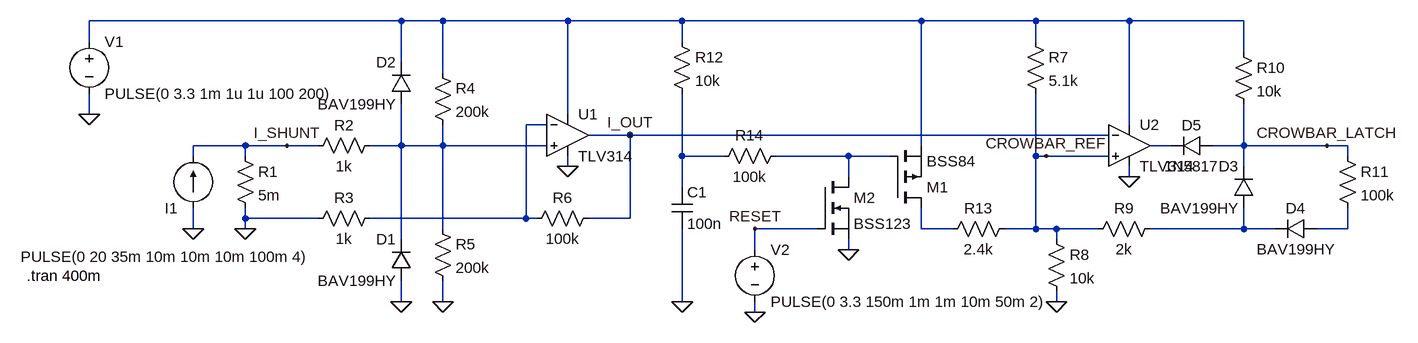
[diagram p0: schematic Crowbar_latch.asc]
Crowbar_latch.asc, the LTspice schematic file:
Version 4.1
SHEET 1 1932 680
WIRE 384 -16 -96 -16
WIRE 448 -16 384 -16
WIRE 640 -16 448 -16
WIRE 816 -16 640 -16
WIRE 1184 -16 816 -16
WIRE 1360 -16 1184 -16
WIRE 1504 -16 1360 -16
WIRE 1680 -16 1504 -16
WIRE -96 16 -96 -16
WIRE 816 16 816 -16
WIRE 1360 16 1360 -16
WIRE 1680 32 1680 -16
WIRE 384 48 384 -16
WIRE 448 64 448 -16
WIRE -96 128 -96 96
WIRE 640 128 640 -16
WIRE 608 144 576 144
WIRE 1504 144 1504 -16
WIRE 736 160 672 160
WIRE 1472 160 736 160
WIRE 144 176 64 176
WIRE 208 176 144 176
WIRE 256 176 208 176
WIRE 384 176 384 112
WIRE 384 176 336 176
WIRE 448 176 448 144
WIRE 448 176 384 176
WIRE 608 176 448 176
WIRE 1184 176 1184 -16
WIRE 1568 176 1536 176
WIRE 1680 176 1680 112
WIRE 1680 176 1632 176
WIRE 1808 176 1680 176
WIRE 1840 176 1808 176
WIRE 64 192 64 176
WIRE 144 192 144 176
WIRE 816 192 816 96
WIRE 880 192 816 192
WIRE 1072 192 960 192
WIRE 1136 192 1072 192
WIRE 1360 192 1360 96
WIRE 1376 192 1360 192
WIRE 1472 192 1376 192
WIRE 1840 192 1840 176
WIRE 640 208 640 192
WIRE 1680 208 1680 176
WIRE 1072 224 1072 192
WIRE 1504 224 1504 208
WIRE 816 240 816 192
WIRE 144 288 144 272
WIRE 256 288 144 288
WIRE 576 288 576 144
WIRE 576 288 336 288
WIRE 592 288 576 288
WIRE 736 288 736 160
WIRE 736 288 672 288
WIRE 64 304 64 272
WIRE 144 304 144 288
WIRE 448 304 448 176
WIRE 1024 304 928 304
WIRE 1184 304 1184 272
WIRE 1232 304 1184 304
WIRE 1360 304 1360 192
WIRE 1360 304 1312 304
WIRE 1392 304 1360 304
WIRE 1456 304 1392 304
WIRE 1680 304 1680 272
WIRE 1680 304 1536 304
WIRE 1728 304 1680 304
WIRE 1840 304 1840 272
WIRE 1840 304 1792 304
WIRE 384 320 384 176
WIRE 1392 320 1392 304
WIRE 928 336 928 304
WIRE 1072 336 1072 320
WIRE 384 416 384 384
WIRE 448 416 448 384
WIRE 816 416 816 304
WIRE 1392 416 1392 400
WIRE 928 432 928 416
FLAG 144 304 0
FLAG -96 128 0
FLAG 64 304 0
FLAG 384 416 0
FLAG 448 416 0
FLAG 640 208 0
FLAG 1504 224 0
FLAG 1392 416 0
FLAG 208 176 I_SHUNT
FLAG 736 160 I_OUT
FLAG 1808 176 CROWBAR_LATCH
FLAG 1376 192 CROWBAR_REF
FLAG 816 416 0
FLAG 1072 336 0
FLAG 928 432 0
FLAG 928 304 RESET
SYMBOL voltage -96 0 R0
WINDOW 123 0 0 Left 0
WINDOW 39 0 0 Left 0
SYMATTR InstName V1
SYMATTR Value PULSE(0 3.3 1m 1u 1u 100 200)
SYMBOL current 64 272 R180
WINDOW 123 0 0 Left 0
WINDOW 39 0 0 Left 0
WINDOW 3 -180 -75 Left 2
SYMATTR Value PULSE(0 20 35m 10m 10m 10m 100m 4)
SYMATTR InstName I1
SYMBOL res 128 176 R0
SYMATTR InstName R1
SYMATTR Value 5m
SYMBOL res 352 160 R90
WINDOW 0 0 56 VBottom 2
WINDOW 3 32 56 VTop 2
SYMATTR InstName R2
SYMATTR Value 1k
SYMBOL res 352 272 R90
WINDOW 0 0 56 VBottom 2
WINDOW 3 32 56 VTop 2
SYMATTR InstName R3
SYMATTR Value 1k
SYMBOL diode 400 384 R180
WINDOW 0 24 64 Left 2
WINDOW 3 24 0 Left 2
SYMATTR InstName D1
SYMATTR Value BAV199HY
SYMBOL diode 400 112 R180
WINDOW 0 24 64 Left 2
WINDOW 3 24 0 Left 2
SYMATTR InstName D2
SYMATTR Value BAV199HY
SYMBOL res 432 48 R0
SYMATTR InstName R4
SYMATTR Value 200k
SYMBOL res 432 288 R0
SYMATTR InstName R5
SYMATTR Value 200k
SYMBOL TLV314 640 160 R0
SYMATTR InstName U1
SYMBOL res 688 272 R90
WINDOW 0 0 56 VBottom 2
WINDOW 3 32 56 VTop 2
SYMATTR InstName R6
SYMATTR Value 100k
SYMBOL TLV314 1504 176 R0
SYMATTR InstName U2
SYMBOL res 1344 0 R0
SYMATTR InstName R7
SYMATTR Value 5.1k
SYMBOL res 1376 304 R0
SYMATTR InstName R8
SYMATTR Value 10k
SYMBOL res 1552 288 R90
WINDOW 0 0 56 VBottom 2
WINDOW 3 32 56 VTop 2
SYMATTR InstName R9
SYMATTR Value 2k
SYMBOL diode 1696 272 R180
WINDOW 0 24 64 Left 2
WINDOW 3 24 0 Left 2
SYMATTR InstName D3
SYMATTR Value BAV199HY
SYMBOL res 1664 16 R0
SYMATTR InstName R10
SYMATTR Value 10k
SYMBOL res 1824 176 R0
SYMATTR InstName R11
SYMATTR Value 100k
SYMBOL diode 1792 288 R90
WINDOW 0 0 32 VBottom 2
WINDOW 3 32 32 VTop 2
SYMATTR InstName D4
SYMATTR Value BAV199HY
SYMBOL pmos 1136 272 M180
SYMATTR InstName M1
SYMATTR Value BSS84
SYMBOL res 800 0 R0
SYMATTR InstName R12
SYMATTR Value 10k
SYMBOL cap 800 240 R0
SYMATTR InstName C1
SYMATTR Value 100n
SYMBOL diode 1632 160 R90
WINDOW 0 0 32 VBottom 2
WINDOW 3 32 32 VTop 2
SYMATTR InstName D5
SYMATTR Value 1N5817
SYMBOL res 1328 288 R90
WINDOW 0 0 56 VBottom 2
WINDOW 3 32 56 VTop 2
SYMATTR InstName R13
SYMATTR Value 2.4k
SYMBOL res 976 176 R90
WINDOW 0 0 56 VBottom 2
WINDOW 3 32 56 VTop 2
SYMATTR InstName R14
SYMATTR Value 100k
SYMBOL nmos 1024 224 R0
SYMATTR InstName M2
SYMATTR Value BSS123
SYMBOL voltage 928 320 R0
WINDOW 123 0 0 Left 0
WINDOW 39 0 0 Left 0
SYMATTR InstName V2
SYMATTR Value PULSE(0 3.3 150m 1m 1m 10m 50m 2)
TEXT -192 376 Left 2 !.tran 400m

The netlist it stands for:
* Crowbar_latch.asc
V1 N001 0 PULSE(0 3.3 1m 1u 1u 100 200)
I1 0 I_SHUNT PULSE(0 20 35m 10m 10m 10m 100m 4)
R1 I_SHUNT 0 5m
R2 N003 I_SHUNT 1k
R3 N002 0 1k
D1 0 N003 BAV199HY
D2 N003 N001 BAV199HY
R4 N001 N003 200k
R5 N003 0 200k
* U1: TLV314 (symbol TLV314 not available, pins judged from their places): In+=N003 In-=N002 V+=N001 V-=0 OUT=I_OUT
R6 I_OUT N002 100k
* U2: TLV314 (symbol TLV314 not available, pins judged from their places): In+=CROWBAR_REF In-=I_OUT V+=N001 V-=0 OUT=N004
R7 N001 CROWBAR_REF 5.1k
R8 CROWBAR_REF 0 10k
R9 N008 CROWBAR_REF 2k
D3 N008 CROWBAR_LATCH BAV199HY
R10 N001 CROWBAR_LATCH 10k
R11 CROWBAR_LATCH N009 100k
D4 N009 N008 BAV199HY
M1 N007 N006 N001 N001 BSS84
R12 N001 N005 10k
C1 N005 0 100n
D5 CROWBAR_LATCH N004 1N5817
R13 CROWBAR_REF N007 2.4k
R14 N006 N005 100k
M2 N006 RESET 0 0 BSS123
V2 RESET 0 PULSE(0 3.3 150m 1m 1m 10m 50m 2)
.model D D
.lib standard.dio
.model NMOS NMOS
.model PMOS PMOS
.lib standard.mos
.tran 400m
.backanno
.end